# Altium project 5D-MiniSystem.PrjPcb
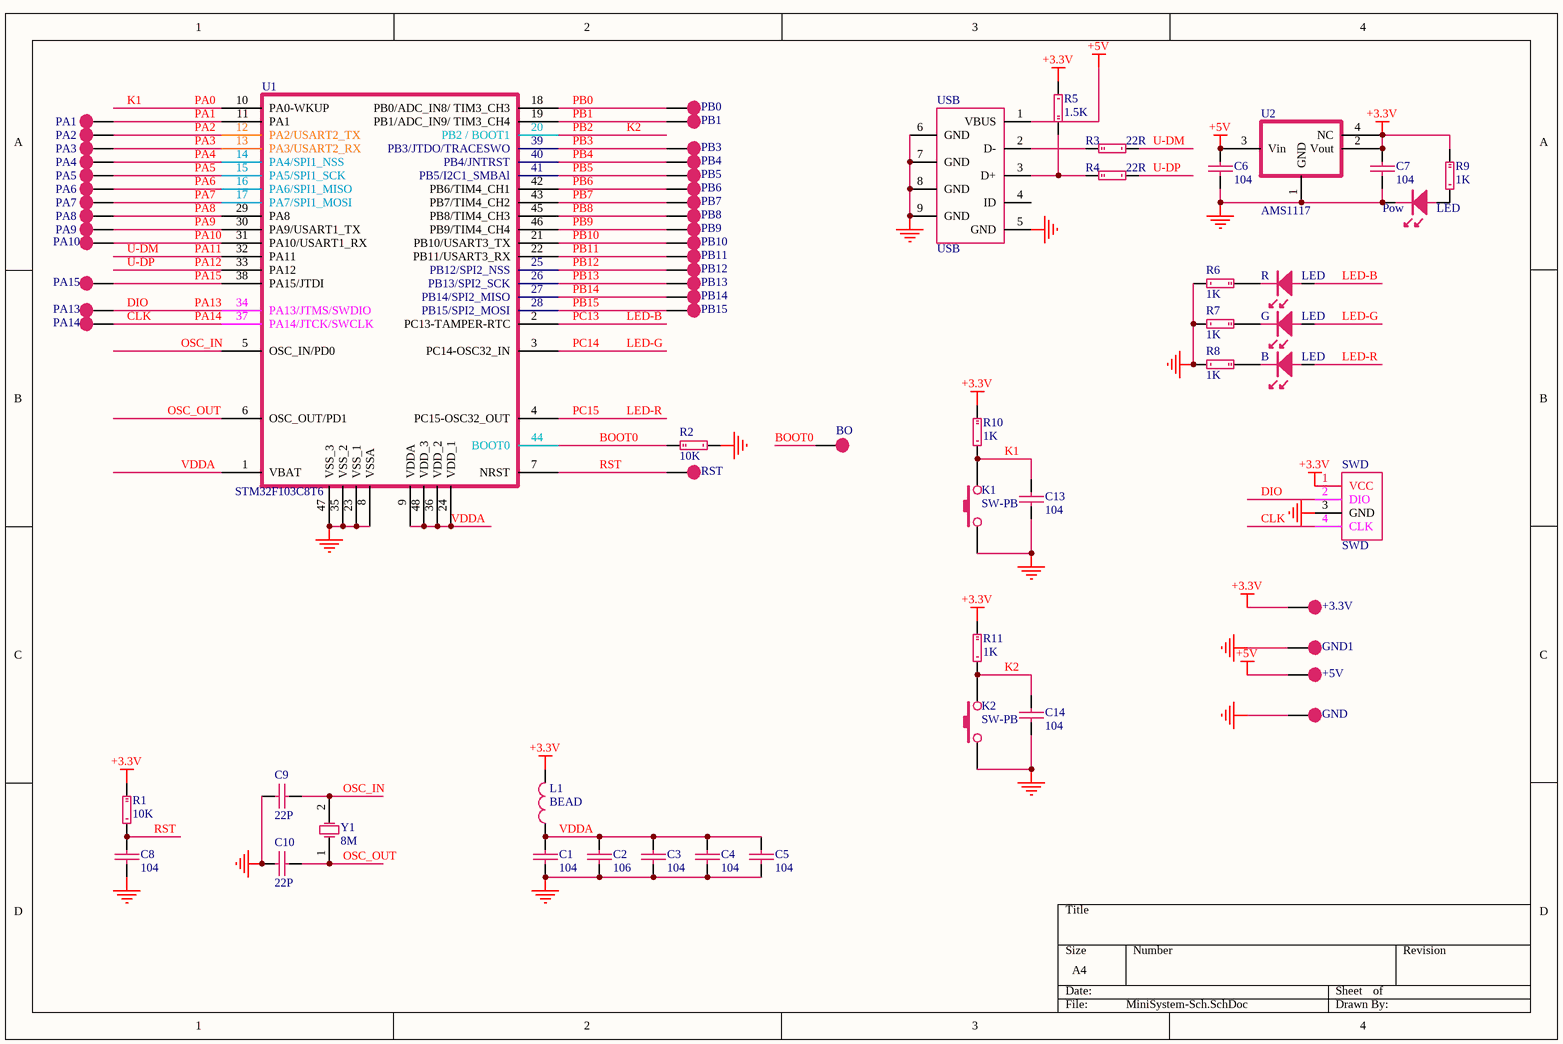
[diagram p0: MiniSystem-Sch.SchDoc]
1 sheet, 69 parts. Net scope: global (net labels, ports and power ports of the same name join across sheets).
Board files: MiniSystem-Pcb.PcbDoc, MiniSystem-Pcb-All.PcbDoc

## Sheet MiniSystem-Sch.SchDoc
size A4

### Parts
+3.3V  (no value)  [TP]
+5V  (no value)  [TP]
B  LED  [LED0805]
BO  (no value)  [TP]
C1  104  [C0603]
C2  106  [C0805]
C3  104  [C0603]
C4  104  [C0603]
C5  104  [C0603]
C6  104  [C0603]
C7  104  [C0603]
C8  104  [C0603]
C9  22P  [C0603]
C10  22P  [C0603]
C13  104  [C0603]
C14  104  [C0603]
G  LED  [LED0805]
GND  (no value)  [TP]
GND1  (no value)  [TP]
K1  SW-PB  [SW-Mini]
K2  SW-PB  [SW-Mini]
L1  BEAD  [l0603]
PA1  (no value)  [TP]
PA2  (no value)  [TP]
PA3  (no value)  [TP]
PA4  (no value)  [TP]
PA5  (no value)  [TP]
PA6  (no value)  [TP]
PA7  (no value)  [TP]
PA8  (no value)  [TP]
PA9  (no value)  [TP]
PA10  (no value)  [TP]
PA13  (no value)  [TP]
PA14  (no value)  [TP]
PA15  (no value)  [TP]
PB0  (no value)  [TP]
PB1  (no value)  [TP]
PB3  (no value)  [TP]
PB4  (no value)  [TP]
PB5  (no value)  [TP]
PB6  (no value)  [TP]
PB7  (no value)  [TP]
PB8  (no value)  [TP]
PB9  (no value)  [TP]
PB10  (no value)  [TP]
PB11  (no value)  [TP]
PB12  (no value)  [TP]
PB13  (no value)  [TP]
PB14  (no value)  [TP]
PB15  (no value)  [TP]
Pow  LED  [LED0805]
R  LED  [LED0805]
R1  10K  [R0603]
R2  10K  [R0603]
R3  22R  [R0603]
R4  22R  [R0603]
R5  1.5K  [R0603]
R6  1K  [R0603]
R7  1K  [R0603]
R8  1K  [R0603]
R9  1K  [R0603]
R10  1K  [R0603]
R11  1K  [R0603]
RST  (no value)  [TP]
SWD  SWD  [SWIM_SWD]
U1  STM32F103C8T6  [LQFP48]
U2  AMS1117  [SOT223]
USB  USB  [USB-Micro]
Y1  8M  [XTAL-(5.0X3.2MM)-2P]

### Nets
+3.3V: +3.3V.1 C7.1 L1.2 R1.2 R5.1 R9.2 R10.2 R11.2 SWD.1(VCC) U2.2(Vout) U2.4(NC)
+5V: +5V.1 C6.1 U2.3(Vin) USB.1(VBUS)
GND: C1.2 C2.2 C3.2 C4.2 C5.2 C6.2 C7.2 C8.2 C9.1 C10.1 C13.1 C14.1 GND.1 GND1.1 K1.1 K2.1 Pow.2 R2.1 R6.1 R7.1 R8.1 SWD.3(GND) U1.8(VSSA) U1.23(VSS_1) U1.35(VSS_2) U1.47(VSS_3) U2.1(GND) USB.5(GND) USB.6(GND) USB.7(GND) USB.8(GND) USB.9(GND)
BOOT0: BO.1 R2.2 U1.44(BOOT0)
CLK: PA14.1 SWD.4(CLK) U1.37(PA14/JTCK/SWCLK)  [also labelled PA14]
DIO: PA13.1 SWD.2(DIO) U1.34(PA13/JTMS/SWDIO)  [also labelled PA13]
K1: C13.2 K1.2 R10.1 U1.10(PA0-WKUP)  [also labelled PA0]
K2: C14.2 K2.2 R11.1 U1.20(PB2_/_BOOT1)  [also labelled PB2]
LED-B: R.1 U1.2(PC13-TAMPER-RTC)  [also labelled PC13]
LED-G: G.1 U1.3(PC14-OSC32_IN)  [also labelled PC14]
LED-R: B.1 U1.4(PC15-OSC32_OUT)  [also labelled PC15]
OSC_IN: C9.2 U1.5(OSC_IN/PD0) Y1.2(OSC2)
OSC_OUT: C10.2 U1.6(OSC_OUT/PD1) Y1.1(OSC1)
PA1: PA1.1 U1.11(PA1)
PA2: PA2.1 U1.12(PA2/USART2_TX)
PA3: PA3.1 U1.13(PA3/USART2_RX)
PA4: PA4.1 U1.14(PA4/SPI1_NSS)
PA5: PA5.1 U1.15(PA5/SPI1_SCK)
PA6: PA6.1 U1.16(PA6/SPI1_MISO)
PA7: PA7.1 U1.17(PA7/SPI1_MOSI)
PA8: PA8.1 U1.29(PA8)
PA9: PA9.1 U1.30(PA9/USART1_TX)
PA10: PA10.1 U1.31(PA10/USART1_RX)
PA11: R3.1 U1.32(PA11)  [also labelled U-DM]
PA12: R4.1 U1.33(PA12)  [also labelled U-DP]
PA15: PA15.1 U1.38(PA15/JTDI)
PB0: PB0.1 U1.18(PB0/ADC_IN8/_TIM3_CH3)
PB1: PB1.1 U1.19(PB1/ADC_IN9/_TIM3_CH4)
PB3: PB3.1 U1.39(PB3/JTDO/TRACESWO)
PB4: PB4.1 U1.40(PB4/JNTRST)
PB5: PB5.1 U1.41(PB5/I2C1_SMBAl)
PB6: PB6.1 U1.42(PB6/TIM4_CH1)
PB7: PB7.1 U1.43(PB7/TIM4_CH2)
PB8: PB8.1 U1.45(PB8/TIM4_CH3)
PB9: PB9.1 U1.46(PB9/TIM4_CH4)
PB10: PB10.1 U1.21(PB10/USART3_TX)
PB11: PB11.1 U1.22(PB11/USART3_RX)
PB12: PB12.1 U1.25(PB12/SPI2_NSS)
PB13: PB13.1 U1.26(PB13/SPI2_SCK)
PB14: PB14.1 U1.27(PB14/SPI2_MISO)
PB15: PB15.1 U1.28(PB15/SPI2_MOSI)
RST: C8.1 R1.1 RST.1 U1.7(NRST)
VDDA: C1.1 C2.1 C3.1 C4.1 C5.1 L1.1 U1.1(VBAT) U1.9(VDDA) U1.24(VDD_1) U1.36(VDD_2) U1.48(VDD_3)
NetB_2: B.2 R8.2
NetG_2: G.2 R7.2
NetPow_1: Pow.1 R9.1
NetR3_2: R3.2 USB.2(D-)
NetR4_2: R4.2 R5.2 USB.3(D+)
NetR_2: R.2 R6.2

Not connected (* = marked no-connect by the designer): USB 4(ID)

### Library data of the parts
+3.3V +5V BO GND GND1 PA1-PA10 PA13-PA15 PB0 PB1 PB3-PB15 RST = TP: 测试点/触摸点
B G Pow R = LED: LED灯
C1-C10 C13 C14 = CAP: 无极性电容
K1 K2 = SW-PB: 按键
L1 = INDUCTOR: 磁珠
R1-R11 = RES2: 贴片电阻
SWD = SWD: SWD下载口(STM32)
U1 = STM32F103C8T6: STM32F1单片机48引脚
U2 = AMS1117: 稳压芯片(LDO)
USB = USB: 通用串行总线(USB); 7th Part Field: *; 5th Part Field: *; 4th Part Field: *
Y1 = XTAL: 晶振